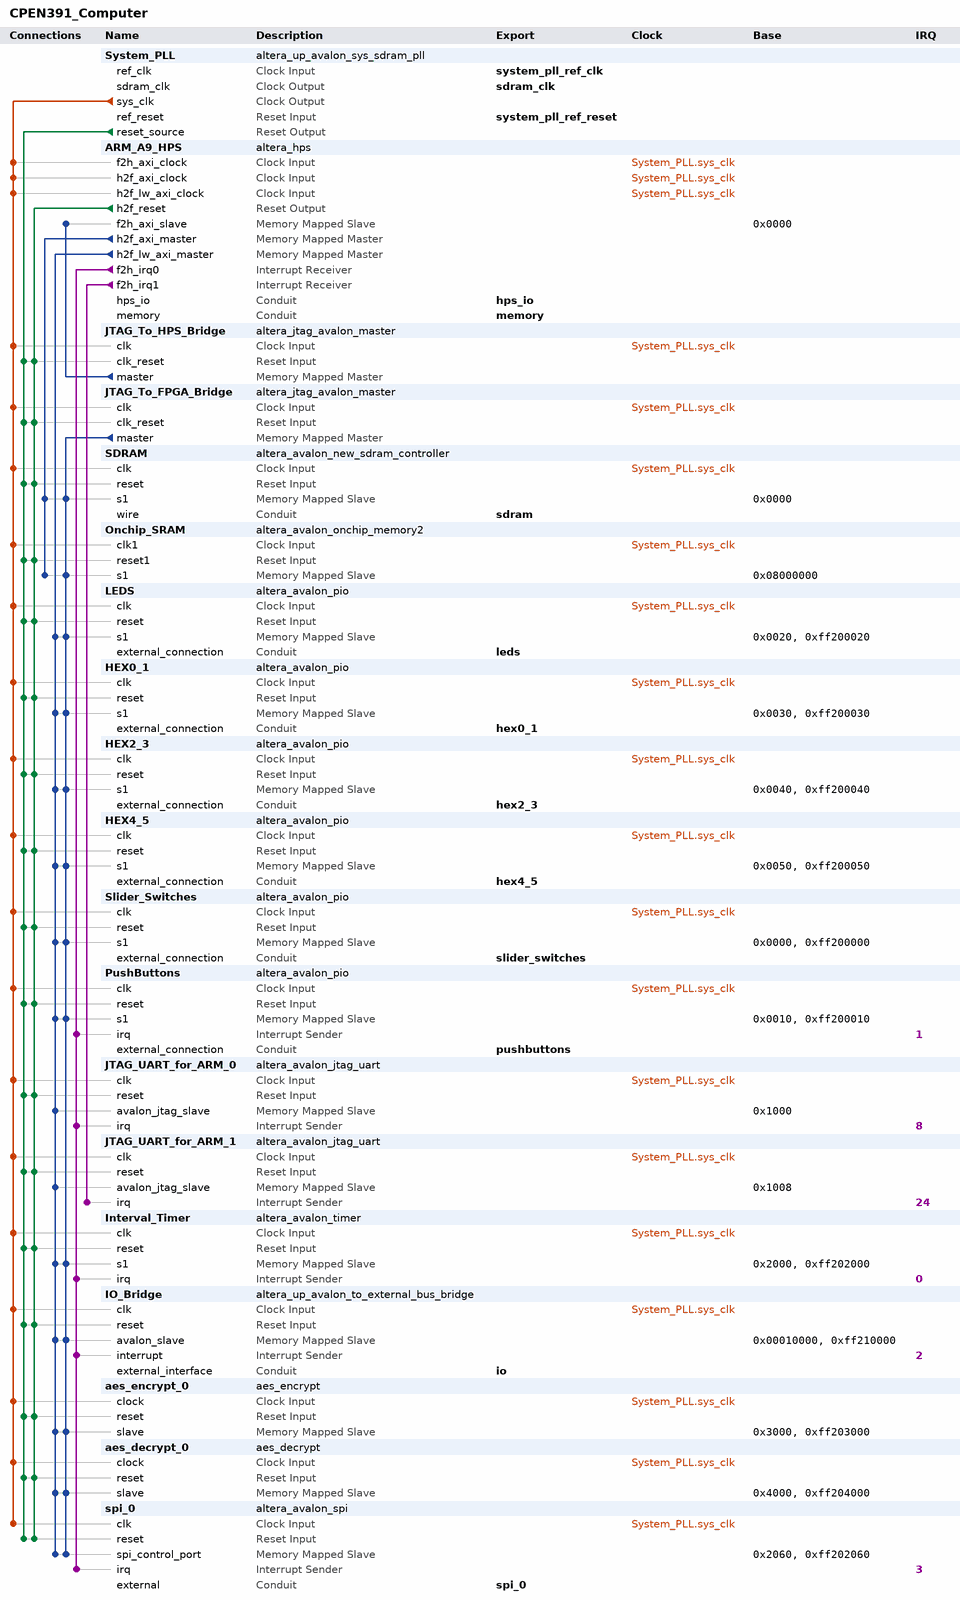
[diagram p0: system contents]
# Platform Designer (Qsys) system CPEN391_Computer, Cyclone V 5CSEMA5F31C6
# Parameters at their usual value, and those the tool derives, are not listed.
package require -exact qsys 16.1
create_system CPEN391_Computer
set_project_property DEVICE_FAMILY {Cyclone V}
set_project_property DEVICE 5CSEMA5F31C6

add_instance System_PLL altera_up_avalon_sys_sdram_pll 16.1
set_instance_parameter_value System_PLL CV_boards DE1-SoC
set_instance_parameter_value System_PLL gui_outclk 50.0
set_instance_parameter_value System_PLL gui_refclk 50.0

add_instance ARM_A9_HPS altera_hps 16.1
set_instance_parameter_value ARM_A9_HPS EMAC1_Mode RGMII
set_instance_parameter_value ARM_A9_HPS EMAC1_PinMuxing {HPS I/O Set 0}
set_instance_parameter_value ARM_A9_HPS F2SCLK_COLDRST_Enable false
set_instance_parameter_value ARM_A9_HPS F2SCLK_DBGRST_Enable false
set_instance_parameter_value ARM_A9_HPS F2SCLK_WARMRST_Enable false
set_instance_parameter_value ARM_A9_HPS F2SINTERRUPT_Enable true
set_instance_parameter_value ARM_A9_HPS F2S_Width 2
set_instance_parameter_value ARM_A9_HPS FPGA_PERIPHERAL_OUTPUT_CLOCK_FREQ_EMAC0_GTX_CLK 100
set_instance_parameter_value ARM_A9_HPS FPGA_PERIPHERAL_OUTPUT_CLOCK_FREQ_EMAC0_MD_CLK 2.5
set_instance_parameter_value ARM_A9_HPS FPGA_PERIPHERAL_OUTPUT_CLOCK_FREQ_EMAC1_GTX_CLK 100
set_instance_parameter_value ARM_A9_HPS FPGA_PERIPHERAL_OUTPUT_CLOCK_FREQ_EMAC1_MD_CLK 2.5
set_instance_parameter_value ARM_A9_HPS HPS_PROTOCOL DDR3
set_instance_parameter_value ARM_A9_HPS I2C0_Mode I2C
set_instance_parameter_value ARM_A9_HPS I2C0_PinMuxing {HPS I/O Set 0}
set_instance_parameter_value ARM_A9_HPS I2C1_Mode I2C
set_instance_parameter_value ARM_A9_HPS I2C1_PinMuxing {HPS I/O Set 0}
set_instance_parameter_value ARM_A9_HPS LWH2F_Enable true
set_instance_parameter_value ARM_A9_HPS MEM_BANKADDR_WIDTH 3
set_instance_parameter_value ARM_A9_HPS MEM_CLK_FREQ 400.0
set_instance_parameter_value ARM_A9_HPS MEM_COL_ADDR_WIDTH 10
set_instance_parameter_value ARM_A9_HPS MEM_DQ_WIDTH 32
set_instance_parameter_value ARM_A9_HPS MEM_DRV_STR RZQ/7
set_instance_parameter_value ARM_A9_HPS MEM_ROW_ADDR_WIDTH 15
set_instance_parameter_value ARM_A9_HPS MEM_RTT_NOM RZQ/4
set_instance_parameter_value ARM_A9_HPS MEM_RTT_WR RZQ/4
set_instance_parameter_value ARM_A9_HPS MEM_TCL 11
set_instance_parameter_value ARM_A9_HPS MEM_TFAW_NS 30.0
set_instance_parameter_value ARM_A9_HPS MEM_TRAS_NS 35.0
set_instance_parameter_value ARM_A9_HPS MEM_TRCD_NS 13.75
set_instance_parameter_value ARM_A9_HPS MEM_TRFC_NS 260.0
set_instance_parameter_value ARM_A9_HPS MEM_TRP_NS 13.75
set_instance_parameter_value ARM_A9_HPS MEM_VENDOR JEDEC
set_instance_parameter_value ARM_A9_HPS MEM_WTCL 8
set_instance_parameter_value ARM_A9_HPS QSPI_Mode {1 SS}
set_instance_parameter_value ARM_A9_HPS QSPI_PinMuxing {HPS I/O Set 0}
set_instance_parameter_value ARM_A9_HPS REF_CLK_FREQ 25.0
set_instance_parameter_value ARM_A9_HPS S2FCLK_USER2CLK 5
set_instance_parameter_value ARM_A9_HPS S2F_Width 2
set_instance_parameter_value ARM_A9_HPS SDIO_Mode {4-bit Data}
set_instance_parameter_value ARM_A9_HPS SDIO_PinMuxing {HPS I/O Set 0}
set_instance_parameter_value ARM_A9_HPS SPIM1_Mode {Single Slave Select}
set_instance_parameter_value ARM_A9_HPS SPIM1_PinMuxing {HPS I/O Set 0}
set_instance_parameter_value ARM_A9_HPS STM_Enable false
set_instance_parameter_value ARM_A9_HPS TIMING_BOARD_AC_SKEW 0.03
set_instance_parameter_value ARM_A9_HPS TIMING_BOARD_AC_TO_CK_SKEW 0.0
set_instance_parameter_value ARM_A9_HPS TIMING_BOARD_DQ_TO_DQS_SKEW 0.0
set_instance_parameter_value ARM_A9_HPS TIMING_BOARD_MAX_CK_DELAY 0.03
set_instance_parameter_value ARM_A9_HPS TIMING_BOARD_MAX_DQS_DELAY 0.02
set_instance_parameter_value ARM_A9_HPS TIMING_BOARD_SKEW_BETWEEN_DQS 0.08
set_instance_parameter_value ARM_A9_HPS TIMING_BOARD_SKEW_CKDQS_DIMM_MAX 0.16
set_instance_parameter_value ARM_A9_HPS TIMING_BOARD_SKEW_CKDQS_DIMM_MIN 0.09
set_instance_parameter_value ARM_A9_HPS TIMING_BOARD_SKEW_WITHIN_DQS 0.01
set_instance_parameter_value ARM_A9_HPS TIMING_TDH 65
set_instance_parameter_value ARM_A9_HPS TIMING_TDQSCK 225
set_instance_parameter_value ARM_A9_HPS TIMING_TDQSQ 125
set_instance_parameter_value ARM_A9_HPS TIMING_TDS 30
set_instance_parameter_value ARM_A9_HPS TIMING_TIH 140
set_instance_parameter_value ARM_A9_HPS TIMING_TIS 180
set_instance_parameter_value ARM_A9_HPS TIMING_TQSH 0.4
set_instance_parameter_value ARM_A9_HPS UART0_Mode {No Flow Control}
set_instance_parameter_value ARM_A9_HPS UART0_PinMuxing {HPS I/O Set 0}
set_instance_parameter_value ARM_A9_HPS USB1_Mode SDR
set_instance_parameter_value ARM_A9_HPS USB1_PinMuxing {HPS I/O Set 0}
set_instance_parameter_value ARM_A9_HPS desired_cfg_clk_mhz 100.0
set_instance_parameter_value ARM_A9_HPS desired_qspi_clk_mhz 400.0

add_instance JTAG_To_HPS_Bridge altera_jtag_avalon_master 16.1

add_instance JTAG_To_FPGA_Bridge altera_jtag_avalon_master 16.1

add_instance SDRAM altera_avalon_new_sdram_controller 16.1
set_instance_parameter_value SDRAM TAC 5.5
set_instance_parameter_value SDRAM TRCD 20.0
set_instance_parameter_value SDRAM TRP 20.0
set_instance_parameter_value SDRAM casLatency 3
set_instance_parameter_value SDRAM columnWidth 10
set_instance_parameter_value SDRAM dataWidth 16
set_instance_parameter_value SDRAM generateSimulationModel true
set_instance_parameter_value SDRAM model single_Micron_MT48LC4M32B2_7_chip
set_instance_parameter_value SDRAM numberOfBanks 4
set_instance_parameter_value SDRAM numberOfChipSelects 1
set_instance_parameter_value SDRAM powerUpDelay 100.0
set_instance_parameter_value SDRAM refreshPeriod 15.625
set_instance_parameter_value SDRAM rowWidth 13

add_instance Onchip_SRAM altera_avalon_onchip_memory2 16.1
set_instance_parameter_value Onchip_SRAM dataWidth 32
set_instance_parameter_value Onchip_SRAM dualPort true
set_instance_parameter_value Onchip_SRAM initMemContent true
set_instance_parameter_value Onchip_SRAM initializationFileName onchip_mem.hex
set_instance_parameter_value Onchip_SRAM memorySize 4096
set_instance_parameter_value Onchip_SRAM singleClockOperation true

add_instance LEDS altera_avalon_pio 16.1
set_instance_parameter_value LEDS direction Output
set_instance_parameter_value LEDS width 10

add_instance HEX0_1 altera_avalon_pio 16.1
set_instance_parameter_value HEX0_1 direction Output
set_instance_parameter_value HEX0_1 width 8

add_instance HEX2_3 altera_avalon_pio 16.1
set_instance_parameter_value HEX2_3 direction Output
set_instance_parameter_value HEX2_3 width 8

add_instance HEX4_5 altera_avalon_pio 16.1
set_instance_parameter_value HEX4_5 direction Output
set_instance_parameter_value HEX4_5 width 8

add_instance Slider_Switches altera_avalon_pio 16.1
set_instance_parameter_value Slider_Switches direction Input
set_instance_parameter_value Slider_Switches width 10

add_instance PushButtons altera_avalon_pio 16.1
set_instance_parameter_value PushButtons bitClearingEdgeCapReg true
set_instance_parameter_value PushButtons captureEdge true
set_instance_parameter_value PushButtons direction Input
set_instance_parameter_value PushButtons edgeType FALLING
set_instance_parameter_value PushButtons generateIRQ true
set_instance_parameter_value PushButtons irqType EDGE
set_instance_parameter_value PushButtons simDoTestBenchWiring true
set_instance_parameter_value PushButtons width 4

add_instance JTAG_UART_for_ARM_0 altera_avalon_jtag_uart 16.1
set_instance_parameter_value JTAG_UART_for_ARM_0 simInteractiveOptions NO_INTERACTIVE_WINDOWS

add_instance JTAG_UART_for_ARM_1 altera_avalon_jtag_uart 16.1
set_instance_parameter_value JTAG_UART_for_ARM_1 simInteractiveOptions NO_INTERACTIVE_WINDOWS

add_instance Interval_Timer altera_avalon_timer 16.1
set_instance_parameter_value Interval_Timer period 125
set_instance_parameter_value Interval_Timer periodUnits MSEC

add_instance IO_Bridge altera_up_avalon_to_external_bus_bridge 16.1
set_instance_parameter_value IO_Bridge addr_size 64
set_instance_parameter_value IO_Bridge addr_size_multiplier Kbytes
set_instance_parameter_value IO_Bridge data_size 16

add_instance aes_encrypt_0 aes_encrypt 1.0

add_instance aes_decrypt_0 aes_decrypt 1.0

add_instance spi_0 altera_avalon_spi 16.1
set_instance_parameter_value spi_0 clockPolarity 0
set_instance_parameter_value spi_0 dataWidth 8
set_instance_parameter_value spi_0 masterSPI true
set_instance_parameter_value spi_0 numberOfSlaves 1
set_instance_parameter_value spi_0 targetClockRate 1000000

# connections
add_connection System_PLL.sys_clk aes_decrypt_0.clock clock
add_connection System_PLL.sys_clk aes_encrypt_0.clock clock
add_connection System_PLL.sys_clk ARM_A9_HPS.f2h_axi_clock clock
add_connection System_PLL.sys_clk ARM_A9_HPS.h2f_axi_clock clock
add_connection System_PLL.sys_clk ARM_A9_HPS.h2f_lw_axi_clock clock
add_connection System_PLL.sys_clk HEX0_1.clk clock
add_connection System_PLL.sys_clk HEX2_3.clk clock
add_connection System_PLL.sys_clk HEX4_5.clk clock
add_connection System_PLL.sys_clk Interval_Timer.clk clock
add_connection System_PLL.sys_clk IO_Bridge.clk clock
add_connection System_PLL.sys_clk JTAG_To_FPGA_Bridge.clk clock
add_connection System_PLL.sys_clk JTAG_To_HPS_Bridge.clk clock
add_connection System_PLL.sys_clk JTAG_UART_for_ARM_0.clk clock
add_connection System_PLL.sys_clk JTAG_UART_for_ARM_1.clk clock
add_connection System_PLL.sys_clk LEDS.clk clock
add_connection System_PLL.sys_clk Onchip_SRAM.clk1 clock
add_connection System_PLL.sys_clk PushButtons.clk clock
add_connection System_PLL.sys_clk SDRAM.clk clock
add_connection System_PLL.sys_clk Slider_Switches.clk clock
add_connection System_PLL.sys_clk spi_0.clk clock
add_connection ARM_A9_HPS.h2f_reset aes_decrypt_0.reset reset
add_connection ARM_A9_HPS.h2f_reset aes_encrypt_0.reset reset
add_connection ARM_A9_HPS.h2f_reset HEX0_1.reset reset
add_connection ARM_A9_HPS.h2f_reset HEX2_3.reset reset
add_connection ARM_A9_HPS.h2f_reset HEX4_5.reset reset
add_connection ARM_A9_HPS.h2f_reset Interval_Timer.reset reset
add_connection ARM_A9_HPS.h2f_reset IO_Bridge.reset reset
add_connection ARM_A9_HPS.h2f_reset JTAG_To_FPGA_Bridge.clk_reset reset
add_connection ARM_A9_HPS.h2f_reset JTAG_To_HPS_Bridge.clk_reset reset
add_connection ARM_A9_HPS.h2f_reset JTAG_UART_for_ARM_0.reset reset
add_connection ARM_A9_HPS.h2f_reset JTAG_UART_for_ARM_1.reset reset
add_connection ARM_A9_HPS.h2f_reset LEDS.reset reset
add_connection ARM_A9_HPS.h2f_reset Onchip_SRAM.reset1 reset
add_connection ARM_A9_HPS.h2f_reset PushButtons.reset reset
add_connection ARM_A9_HPS.h2f_reset SDRAM.reset reset
add_connection ARM_A9_HPS.h2f_reset Slider_Switches.reset reset
add_connection ARM_A9_HPS.h2f_reset spi_0.reset reset
add_connection System_PLL.reset_source aes_decrypt_0.reset reset
add_connection System_PLL.reset_source aes_encrypt_0.reset reset
add_connection System_PLL.reset_source HEX0_1.reset reset
add_connection System_PLL.reset_source HEX2_3.reset reset
add_connection System_PLL.reset_source HEX4_5.reset reset
add_connection System_PLL.reset_source Interval_Timer.reset reset
add_connection System_PLL.reset_source IO_Bridge.reset reset
add_connection System_PLL.reset_source JTAG_To_FPGA_Bridge.clk_reset reset
add_connection System_PLL.reset_source JTAG_To_HPS_Bridge.clk_reset reset
add_connection System_PLL.reset_source JTAG_UART_for_ARM_0.reset reset
add_connection System_PLL.reset_source JTAG_UART_for_ARM_1.reset reset
add_connection System_PLL.reset_source LEDS.reset reset
add_connection System_PLL.reset_source Onchip_SRAM.reset1 reset
add_connection System_PLL.reset_source PushButtons.reset reset
add_connection System_PLL.reset_source SDRAM.reset reset
add_connection System_PLL.reset_source Slider_Switches.reset reset
add_connection System_PLL.reset_source spi_0.reset reset
add_connection ARM_A9_HPS.h2f_axi_master Onchip_SRAM.s1 avalon
set_connection_parameter_value ARM_A9_HPS.h2f_axi_master/Onchip_SRAM.s1 baseAddress 0x08000000
add_connection ARM_A9_HPS.h2f_axi_master SDRAM.s1 avalon
set_connection_parameter_value ARM_A9_HPS.h2f_axi_master/SDRAM.s1 baseAddress 0x0000
add_connection ARM_A9_HPS.h2f_lw_axi_master aes_decrypt_0.slave avalon
set_connection_parameter_value ARM_A9_HPS.h2f_lw_axi_master/aes_decrypt_0.slave baseAddress 0x4000
add_connection ARM_A9_HPS.h2f_lw_axi_master aes_encrypt_0.slave avalon
set_connection_parameter_value ARM_A9_HPS.h2f_lw_axi_master/aes_encrypt_0.slave baseAddress 0x3000
add_connection ARM_A9_HPS.h2f_lw_axi_master HEX0_1.s1 avalon
set_connection_parameter_value ARM_A9_HPS.h2f_lw_axi_master/HEX0_1.s1 baseAddress 0x0030
add_connection ARM_A9_HPS.h2f_lw_axi_master HEX2_3.s1 avalon
set_connection_parameter_value ARM_A9_HPS.h2f_lw_axi_master/HEX2_3.s1 baseAddress 0x0040
add_connection ARM_A9_HPS.h2f_lw_axi_master HEX4_5.s1 avalon
set_connection_parameter_value ARM_A9_HPS.h2f_lw_axi_master/HEX4_5.s1 baseAddress 0x0050
add_connection ARM_A9_HPS.h2f_lw_axi_master Interval_Timer.s1 avalon
set_connection_parameter_value ARM_A9_HPS.h2f_lw_axi_master/Interval_Timer.s1 baseAddress 0x2000
add_connection ARM_A9_HPS.h2f_lw_axi_master IO_Bridge.avalon_slave avalon
set_connection_parameter_value ARM_A9_HPS.h2f_lw_axi_master/IO_Bridge.avalon_slave baseAddress 0x00010000
add_connection ARM_A9_HPS.h2f_lw_axi_master JTAG_UART_for_ARM_0.avalon_jtag_slave avalon
set_connection_parameter_value ARM_A9_HPS.h2f_lw_axi_master/JTAG_UART_for_ARM_0.avalon_jtag_slave baseAddress 0x1000
add_connection ARM_A9_HPS.h2f_lw_axi_master JTAG_UART_for_ARM_1.avalon_jtag_slave avalon
set_connection_parameter_value ARM_A9_HPS.h2f_lw_axi_master/JTAG_UART_for_ARM_1.avalon_jtag_slave baseAddress 0x1008
add_connection ARM_A9_HPS.h2f_lw_axi_master LEDS.s1 avalon
set_connection_parameter_value ARM_A9_HPS.h2f_lw_axi_master/LEDS.s1 baseAddress 0x0020
add_connection ARM_A9_HPS.h2f_lw_axi_master PushButtons.s1 avalon
set_connection_parameter_value ARM_A9_HPS.h2f_lw_axi_master/PushButtons.s1 baseAddress 0x0010
add_connection ARM_A9_HPS.h2f_lw_axi_master Slider_Switches.s1 avalon
set_connection_parameter_value ARM_A9_HPS.h2f_lw_axi_master/Slider_Switches.s1 baseAddress 0x0000
add_connection ARM_A9_HPS.h2f_lw_axi_master spi_0.spi_control_port avalon
set_connection_parameter_value ARM_A9_HPS.h2f_lw_axi_master/spi_0.spi_control_port baseAddress 0x2060
add_connection JTAG_To_FPGA_Bridge.master aes_decrypt_0.slave avalon
set_connection_parameter_value JTAG_To_FPGA_Bridge.master/aes_decrypt_0.slave baseAddress 0xff204000
add_connection JTAG_To_FPGA_Bridge.master aes_encrypt_0.slave avalon
set_connection_parameter_value JTAG_To_FPGA_Bridge.master/aes_encrypt_0.slave baseAddress 0xff203000
add_connection JTAG_To_FPGA_Bridge.master HEX0_1.s1 avalon
set_connection_parameter_value JTAG_To_FPGA_Bridge.master/HEX0_1.s1 baseAddress 0xff200030
add_connection JTAG_To_FPGA_Bridge.master HEX2_3.s1 avalon
set_connection_parameter_value JTAG_To_FPGA_Bridge.master/HEX2_3.s1 baseAddress 0xff200040
add_connection JTAG_To_FPGA_Bridge.master HEX4_5.s1 avalon
set_connection_parameter_value JTAG_To_FPGA_Bridge.master/HEX4_5.s1 baseAddress 0xff200050
add_connection JTAG_To_FPGA_Bridge.master Interval_Timer.s1 avalon
set_connection_parameter_value JTAG_To_FPGA_Bridge.master/Interval_Timer.s1 baseAddress 0xff202000
add_connection JTAG_To_FPGA_Bridge.master IO_Bridge.avalon_slave avalon
set_connection_parameter_value JTAG_To_FPGA_Bridge.master/IO_Bridge.avalon_slave baseAddress 0xff210000
add_connection JTAG_To_FPGA_Bridge.master LEDS.s1 avalon
set_connection_parameter_value JTAG_To_FPGA_Bridge.master/LEDS.s1 baseAddress 0xff200020
add_connection JTAG_To_FPGA_Bridge.master Onchip_SRAM.s1 avalon
set_connection_parameter_value JTAG_To_FPGA_Bridge.master/Onchip_SRAM.s1 baseAddress 0x08000000
add_connection JTAG_To_FPGA_Bridge.master PushButtons.s1 avalon
set_connection_parameter_value JTAG_To_FPGA_Bridge.master/PushButtons.s1 baseAddress 0xff200010
add_connection JTAG_To_FPGA_Bridge.master SDRAM.s1 avalon
set_connection_parameter_value JTAG_To_FPGA_Bridge.master/SDRAM.s1 baseAddress 0x0000
add_connection JTAG_To_FPGA_Bridge.master Slider_Switches.s1 avalon
set_connection_parameter_value JTAG_To_FPGA_Bridge.master/Slider_Switches.s1 baseAddress 0xff200000
add_connection JTAG_To_FPGA_Bridge.master spi_0.spi_control_port avalon
set_connection_parameter_value JTAG_To_FPGA_Bridge.master/spi_0.spi_control_port baseAddress 0xff202060
add_connection JTAG_To_HPS_Bridge.master ARM_A9_HPS.f2h_axi_slave avalon
set_connection_parameter_value JTAG_To_HPS_Bridge.master/ARM_A9_HPS.f2h_axi_slave baseAddress 0x0000
add_connection ARM_A9_HPS.f2h_irq0 Interval_Timer.irq interrupt
set_connection_parameter_value ARM_A9_HPS.f2h_irq0/Interval_Timer.irq irqNumber 0
add_connection ARM_A9_HPS.f2h_irq0 IO_Bridge.interrupt interrupt
set_connection_parameter_value ARM_A9_HPS.f2h_irq0/IO_Bridge.interrupt irqNumber 2
add_connection ARM_A9_HPS.f2h_irq0 JTAG_UART_for_ARM_0.irq interrupt
set_connection_parameter_value ARM_A9_HPS.f2h_irq0/JTAG_UART_for_ARM_0.irq irqNumber 8
add_connection ARM_A9_HPS.f2h_irq0 PushButtons.irq interrupt
set_connection_parameter_value ARM_A9_HPS.f2h_irq0/PushButtons.irq irqNumber 1
add_connection ARM_A9_HPS.f2h_irq0 spi_0.irq interrupt
set_connection_parameter_value ARM_A9_HPS.f2h_irq0/spi_0.irq irqNumber 3
add_connection ARM_A9_HPS.f2h_irq1 JTAG_UART_for_ARM_1.irq interrupt
set_connection_parameter_value ARM_A9_HPS.f2h_irq1/JTAG_UART_for_ARM_1.irq irqNumber 24

# exported interfaces
add_interface hex0_1 conduit end
set_interface_property hex0_1 EXPORT_OF HEX0_1.external_connection
add_interface hex2_3 conduit end
set_interface_property hex2_3 EXPORT_OF HEX2_3.external_connection
add_interface hex4_5 conduit end
set_interface_property hex4_5 EXPORT_OF HEX4_5.external_connection
add_interface hps_io conduit end
set_interface_property hps_io EXPORT_OF ARM_A9_HPS.hps_io
add_interface io conduit end
set_interface_property io EXPORT_OF IO_Bridge.external_interface
add_interface leds conduit end
set_interface_property leds EXPORT_OF LEDS.external_connection
add_interface memory conduit end
set_interface_property memory EXPORT_OF ARM_A9_HPS.memory
add_interface pushbuttons conduit end
set_interface_property pushbuttons EXPORT_OF PushButtons.external_connection
add_interface sdram conduit end
set_interface_property sdram EXPORT_OF SDRAM.wire
add_interface sdram_clk clock source
set_interface_property sdram_clk EXPORT_OF System_PLL.sdram_clk
add_interface slider_switches conduit end
set_interface_property slider_switches EXPORT_OF Slider_Switches.external_connection
add_interface spi_0 conduit end
set_interface_property spi_0 EXPORT_OF spi_0.external
add_interface system_pll_ref_clk clock sink
set_interface_property system_pll_ref_clk EXPORT_OF System_PLL.ref_clk
add_interface system_pll_ref_reset reset sink
set_interface_property system_pll_ref_reset EXPORT_OF System_PLL.ref_reset

set_interconnect_requirement {$system} qsys_mm.clockCrossingAdapter HANDSHAKE
set_interconnect_requirement {$system} qsys_mm.enableEccProtection FALSE
set_interconnect_requirement {$system} qsys_mm.insertDefaultSlave FALSE
set_interconnect_requirement {$system} qsys_mm.maxAdditionalLatency 1

save_system CPEN391_Computer.qsys
